# Altium schematic sheet ROV_SCHE_ustlayer.SchDoc
size A
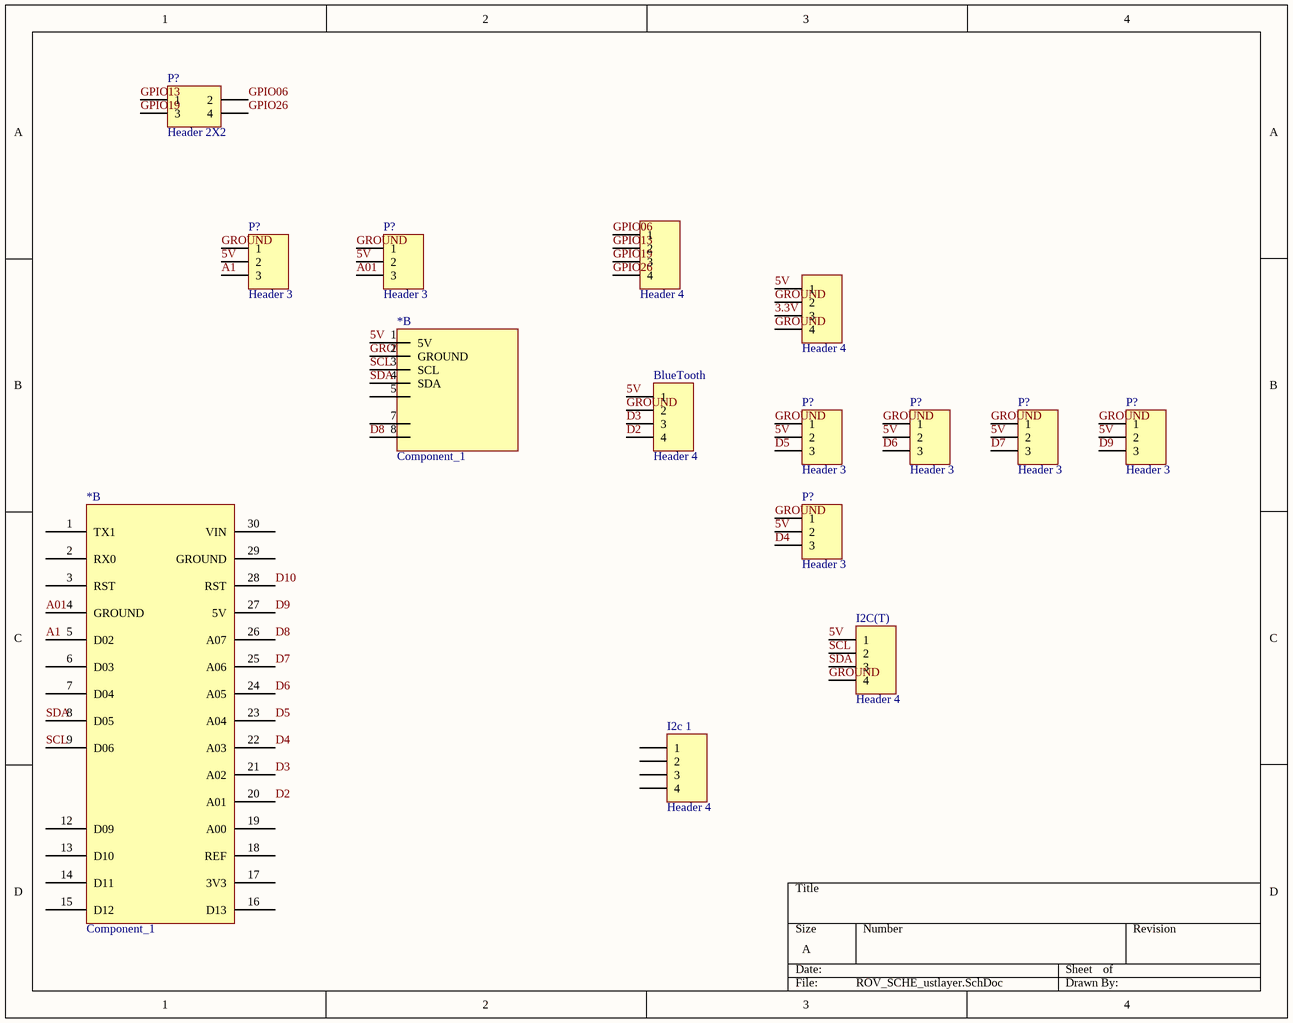
[diagram p0: ROV_SCHE_ustlayer.SchDoc]

## Parts
(Parts that share a designator on the sheet are numbered #1, #2 ... from top to bottom, then left to right.)
*#1  Component_1  [PCBComponent_1]  (part A of 2)
*#2  Component_1  [PCBComponent_1]  (part B of 2)
*#3  Component_1  [Arduino Nano]  (part A of 2)
*#4  Component_1  [Arduino Nano]  (part B of 2)
BlueTooth  Header 4  [HDR1X4]
Extra2  Header 4  [HDR1X4]
EXTRA_0  Header 4  [HDR1X4]
I2C(T)  Header 4  [HDR1X4]
I2c_1  Header 4  [HDR1X4]
P?#1  Header 2X2  [HDR2X2]
P?#2  Header 3  [HDR1X3]
P?#3  Header 3  [HDR1X3]
P?#4  Header 3  [HDR1X3]
P?#5  Header 3  [HDR1X3]
P?#6  Header 3  [HDR1X3]
P?#7  Header 3  [HDR1X3]
P?#8  Header 3  [HDR1X3]

## Nets
3.3V: Extra2.3
5V: *#2.1(5V) BlueTooth.1 Extra2.1 I2C(T).1 P?#2.2 P?#3.2 P?#4.2 P?#5.2 P?#6.2 P?#7.2 P?#8.2
A01: *#4.4(GROUND) P?#3.3
A1: *#4.5(D02) P?#2.3
D2: *#4.20(A01) BlueTooth.4
D3: *#4.21(A02) BlueTooth.3
D4: *#4.22(A03) P?#8.3
D5: *#4.23(A04) P?#4.3
D6: *#4.24(A05) P?#5.3
D7: *#4.25(A06) P?#6.3
D8: *#2.8 *#4.26(A07)
D9: *#4.27(5V) P?#7.3
D10: *#4.28(RST)
GPIO06: EXTRA_0.1 P?#1.2
GPIO13: EXTRA_0.2 P?#1.1
GPIO19: EXTRA_0.3 P?#1.3
GPIO26: EXTRA_0.4 P?#1.4
GROUND: *#2.2(GROUND) BlueTooth.2 Extra2.2 Extra2.4 I2C(T).4 P?#2.1 P?#3.1 P?#4.1 P?#5.1 P?#6.1 P?#7.1 P?#8.1
SCL: *#2.3(SCL) *#4.9(D06) I2C(T).2
SDA: *#2.4(SDA) *#4.8(D05) I2C(T).3

Not connected (* = marked no-connect by the designer): *#2 5 7; *#4 1(TX1) 2(RX0) 3(RST) 6(D03) 7(D04) 12(D09) 13(D10) 14(D11) 15(D12) 16(D13) 17(3V3) 18(REF) 19(A00) 29(GROUND) 30(VIN); I2c_1 1 2 3 4

## Library data of the parts
BlueTooth Extra2 EXTRA_0 I2C(T) I2c_1 = Header 4: Header, 4-Pin; LatestRevisionDate: 17-Jul-2002; LatestRevisionNote: Re-released for DXP Platform.; Publisher: Altium Limited
P?#1 = Header 2X2: Header, 2-Pin, Dual row; LatestRevisionDate: 17-Jul-2002; LatestRevisionNote: Re-released for DXP Platform.; Publisher: Altium Limited
P?#2-P?#8 = Header 3: Header, 3-Pin; LatestRevisionDate: 17-Jul-2002; LatestRevisionNote: Re-released for DXP Platform.; Publisher: Altium Limited